# Altium schematic sheet ADC.SchDoc
size 381 x 254 mm
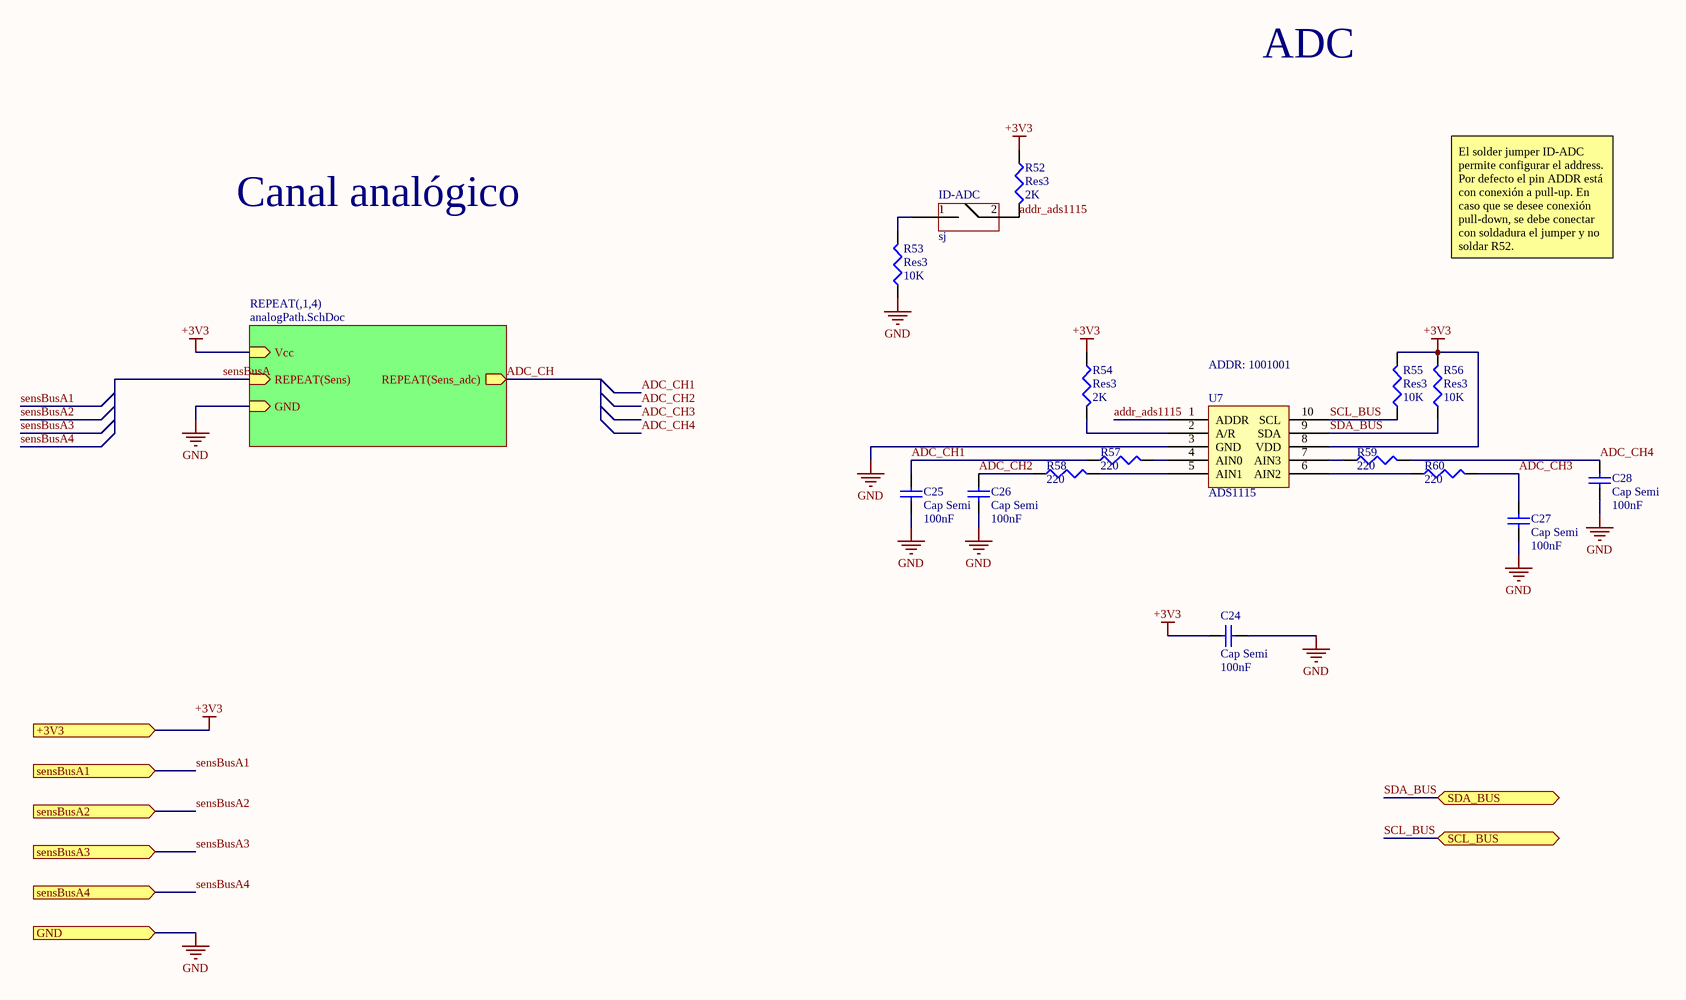
[diagram p0: ADC.SchDoc]

## Parts
C24  Cap Semi  value 100nF  [1608[0603]]
C25  Cap Semi  value 100nF  [1608[0603]]
C26  Cap Semi  value 100nF  [1608[0603]]
C27  Cap Semi  value 100nF  [1608[0603]]
C28  Cap Semi  value 100nF  [1608[0603]]
ID-ADC  sj  [SJ2]
R52  Res3  value 2K  [J1-0603]
R53  Res3  value 10K  [J1-0603]
R54  Res3  value 2K  [J1-0603]
R55  Res3  value 10K  [J1-0603]
R56  Res3  value 10K  [J1-0603]
R57  value 220  [J1-0603]  (hidden comment: Res3)
R58  value 220  [J1-0603]  (hidden comment: Res3)
R59  value 220  [J1-0603]  (hidden comment: Res3)
R60  value 220  [J1-0603]  (hidden comment: Res3)
U7  ADS1115  [VSSOP - 10]

## Sub-sheets
REPEAT(,1,4) = analogPath.SchDoc: Vcc (in), REPEAT(Sens) (in), GND (in), REPEAT(Sens_adc) (out)

## Ports
+3V3 (in), GND (in), SCL_BUS (bidir), SDA_BUS (bidir), sensBusA1 (in), sensBusA2 (in), sensBusA3 (in), sensBusA4 (in)

## Nets
+3V3: C24.2 R52.1 R54.1 R55.2 R56.2 U7.8(VDD) ; port +3V3, sheet REPEAT(,1,4)/Vcc
GND: C24.1 C25.1 C26.1 C27.1 C28.1 R53.1 U7.3(GND) ; port GND, sheet REPEAT(,1,4)/GND
ADC_CH: sheet REPEAT(,1,4)/REPEAT(Sens_adc)
ADC_CH1: C25.2 R57.1
ADC_CH2: C26.2 R58.1
ADC_CH3: C27.2 R60.2
ADC_CH4: C28.2 R59.2
addr_ads1115: ID-ADC.2 R52.2 U7.1(ADDR)
SCL_BUS: R55.1 U7.10(SCL) ; port SCL_BUS
SDA_BUS: R56.1 U7.9(SDA) ; port SDA_BUS
sensBusA: sheet REPEAT(,1,4)/REPEAT(Sens)
sensBusA1: port sensBusA1
sensBusA2: port sensBusA2
sensBusA3: port sensBusA3
sensBusA4: port sensBusA4
NetID-ADC_1: ID-ADC.1 R53.2
NetR54_2: R54.2 U7.2(A/R)
NetR57_2: R57.2 U7.4(AIN0)
NetR58_2: R58.2 U7.5(AIN1)
NetR59_1: R59.1 U7.7(AIN3)
NetR60_1: R60.1 U7.6(AIN2)

## Notes on the sheet
- ADC
- Canal analógico
- El solder jumper ID-ADC permite configurar el address. Por defecto el pin ADDR está con conexión a pull-up. En caso que se desee conexión pull-down, se debe conectar con soldadura el jumper y no soldar R52.
- (near U7) ADDR: 1001001

## Library data of the parts
C24 C26 C28 = Cap Semi: Capacitor (Semiconductor SIM Model); Manufacturer: Taiyo Yuden; Manufacturer Part Number: UMK107B104KAHT; Published: 8-Jun-2000; LatestRevisionDate: 29-May-2009; LatestRevisionNote: IPC-7351 Footprint Added.; PackageReference: C0603; Publisher: Altium Limited; PackageDescription: Chip Capacitor; Supplier 1: LCSC; Supplier Part Number 1: C386152
C25 C27 = Cap Semi: Capacitor (Semiconductor SIM Model); Manufacturer Part Number: UMK107B104KAHT; Manufacturer: Taiyo Yuden; Published: 8-Jun-2000; LatestRevisionDate: 29-May-2009; LatestRevisionNote: IPC-7351 Footprint Added.; PackageReference: C0603; Publisher: Altium Limited; PackageDescription: Chip Capacitor; Supplier 1: LCSC; Supplier Part Number 1: C386152
ID-ADC = Jumper: solder jumper generic
R52 R54 = Res3: Resistor; Manufacturer: YAGEO; Manufacturer Part Number: RC0603FR-072KL; Published: 8-Jun-2000; LatestRevisionDate: 29-May-2009; LatestRevisionNote: IPC-7351 Footprint Added.; PackageReference: J1-0603; Publisher: Altium Limited; PackageDescription: Chip Resistor; Supplier 1: LCSC; Supplier Part Number 1: C105576
R53 R55 R56 = Res3: Resistor; Manufacturer: PANASONIC; Manufacturer Part Number: ERJPA3F1002V; Published: 8-Jun-2000; LatestRevisionDate: 29-May-2009; LatestRevisionNote: IPC-7351 Footprint Added.; PackageReference: J1-0603; Publisher: Altium Limited; PackageDescription: Chip Resistor; Supplier 1: LCSC; Supplier Part Number 1: C441927
R57-R60 = Res3: Resistor; Manufacturer Part Number: RC0603FR-07220RL; Manufacturer: YAGEO; Published: 8-Jun-2000; LatestRevisionDate: 29-May-2009; LatestRevisionNote: IPC-7351 Footprint Added.; PackageReference: J1-0603; Publisher: Altium Limited; PackageDescription: Chip Resistor; Supplier 1: LCSC; Supplier Part Number 1: C107696
U7 = ADS1115QDGSRQ1: Analog To Digital Converters (ADCs) VSSOP-10 RoHS; Manufacturer: Texas Instruments; Supplier 1: LCSC; Supplier Part Number 1: C172375; Manufacturer Part Number: ADS1115QDGSRQ1; Package: VSSOP-10